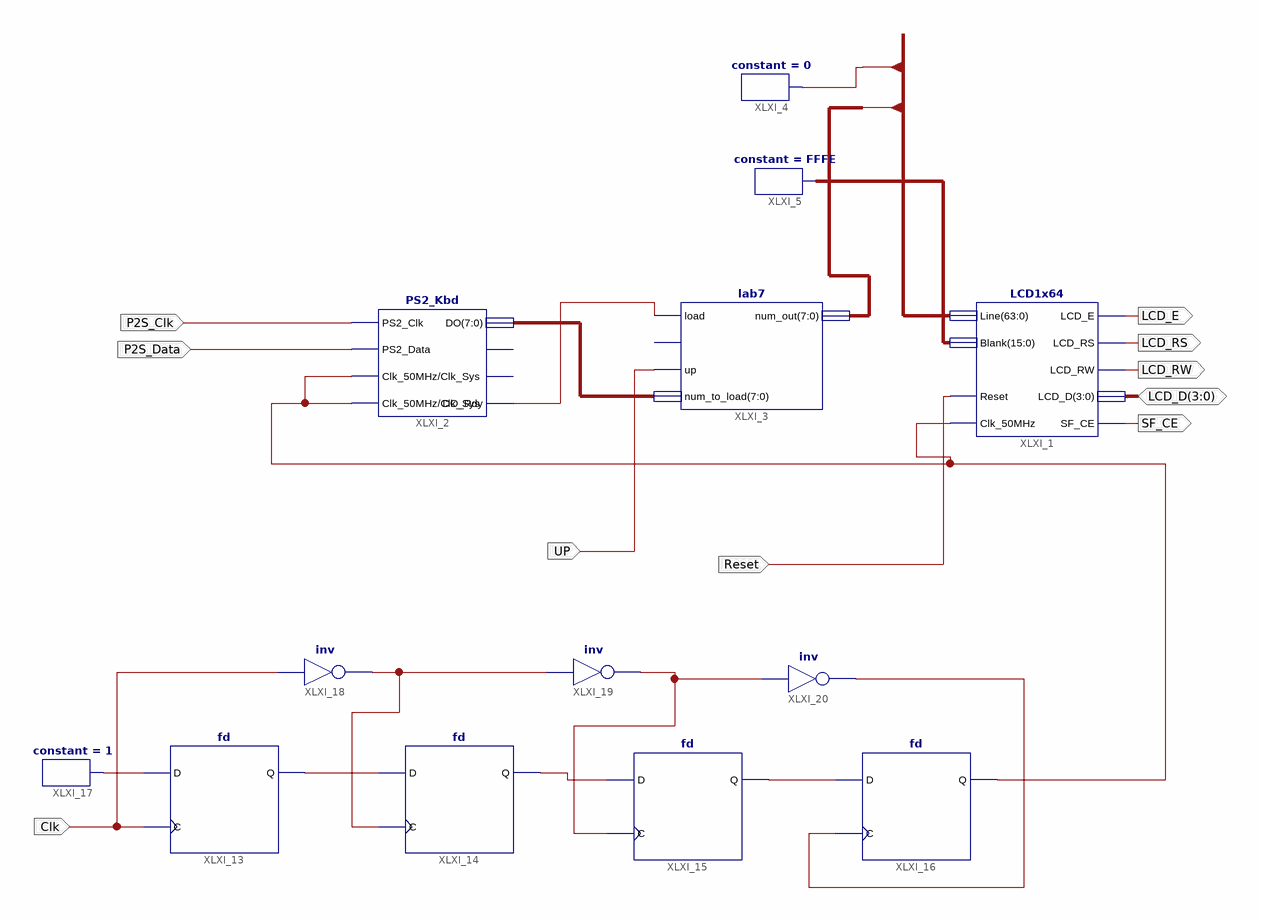
[diagram p0: schematic sheet 1]
// Xilinx ISE schematic lab7_schem.sch (spartan3e) as structural Verilog: 13 symbols, 10 ports
module lab7_schem (
  input  P2S_Clk,
  input  P2S_Data,
  input  Reset,
  input  UP,
  input  Clk,
  inout  [3:0] LCD_D,
  output LCD_E,
  output LCD_RS,
  output LCD_RW,
  output SF_CE
);

  wire XLXN_15, XLXN_20, XLXN_40, XLXN_44, XLXN_45, XLXN_46, XLXN_48, XLXN_49, XLXN_50, XLXN_54;
  wire [7:0] S, XLXN_14, XLXN_19;
  wire [15:0] XLXN_10;

  LCD1x64 XLXI_1 (
    .Clk_50MHz(XLXN_54), .Reset(Reset), .Line(S), .Blank(XLXN_10), .LCD_D(LCD_D), .LCD_E(LCD_E),
    .LCD_RW(LCD_RW), .LCD_RS(LCD_RS), .SF_CE(SF_CE));
  PS2_Kbd XLXI_2 (
    .PS2_Clk(P2S_Clk), .PS2_Data(P2S_Data), .Clk_50MHz(XLXN_54), .DO_Rdy(XLXN_20), .DO(XLXN_19),
    .Clk_Sys(XLXN_54));  // open: E0, F0
  lab7 XLXI_3 (.load(XLXN_20), .up(UP), .num_to_load(XLXN_19), .num_out(XLXN_14));  // open: clk
  constant #(.CValue("0")) XLXI_4 (.O(XLXN_15));
  constant #(.CValue("FFFE")) XLXI_5 (.O(XLXN_10));
  fd XLXI_13 (.C(Clk), .D(XLXN_40), .Q(XLXN_48));
  fd XLXI_14 (.C(XLXN_44), .D(XLXN_48), .Q(XLXN_49));
  fd XLXI_15 (.C(XLXN_45), .D(XLXN_49), .Q(XLXN_50));
  fd XLXI_16 (.C(XLXN_46), .D(XLXN_50), .Q(XLXN_54));
  constant #(.CValue("1")) XLXI_17 (.O(XLXN_40));
  not XLXI_18 (XLXN_44, Clk);
  not XLXI_19 (XLXN_45, XLXN_44);
  not XLXI_20 (XLXN_46, XLXN_45);
endmodule
